# EAGLE design X15-ESC-CONTROLLER - Copy (EAGLE 9.6.2)
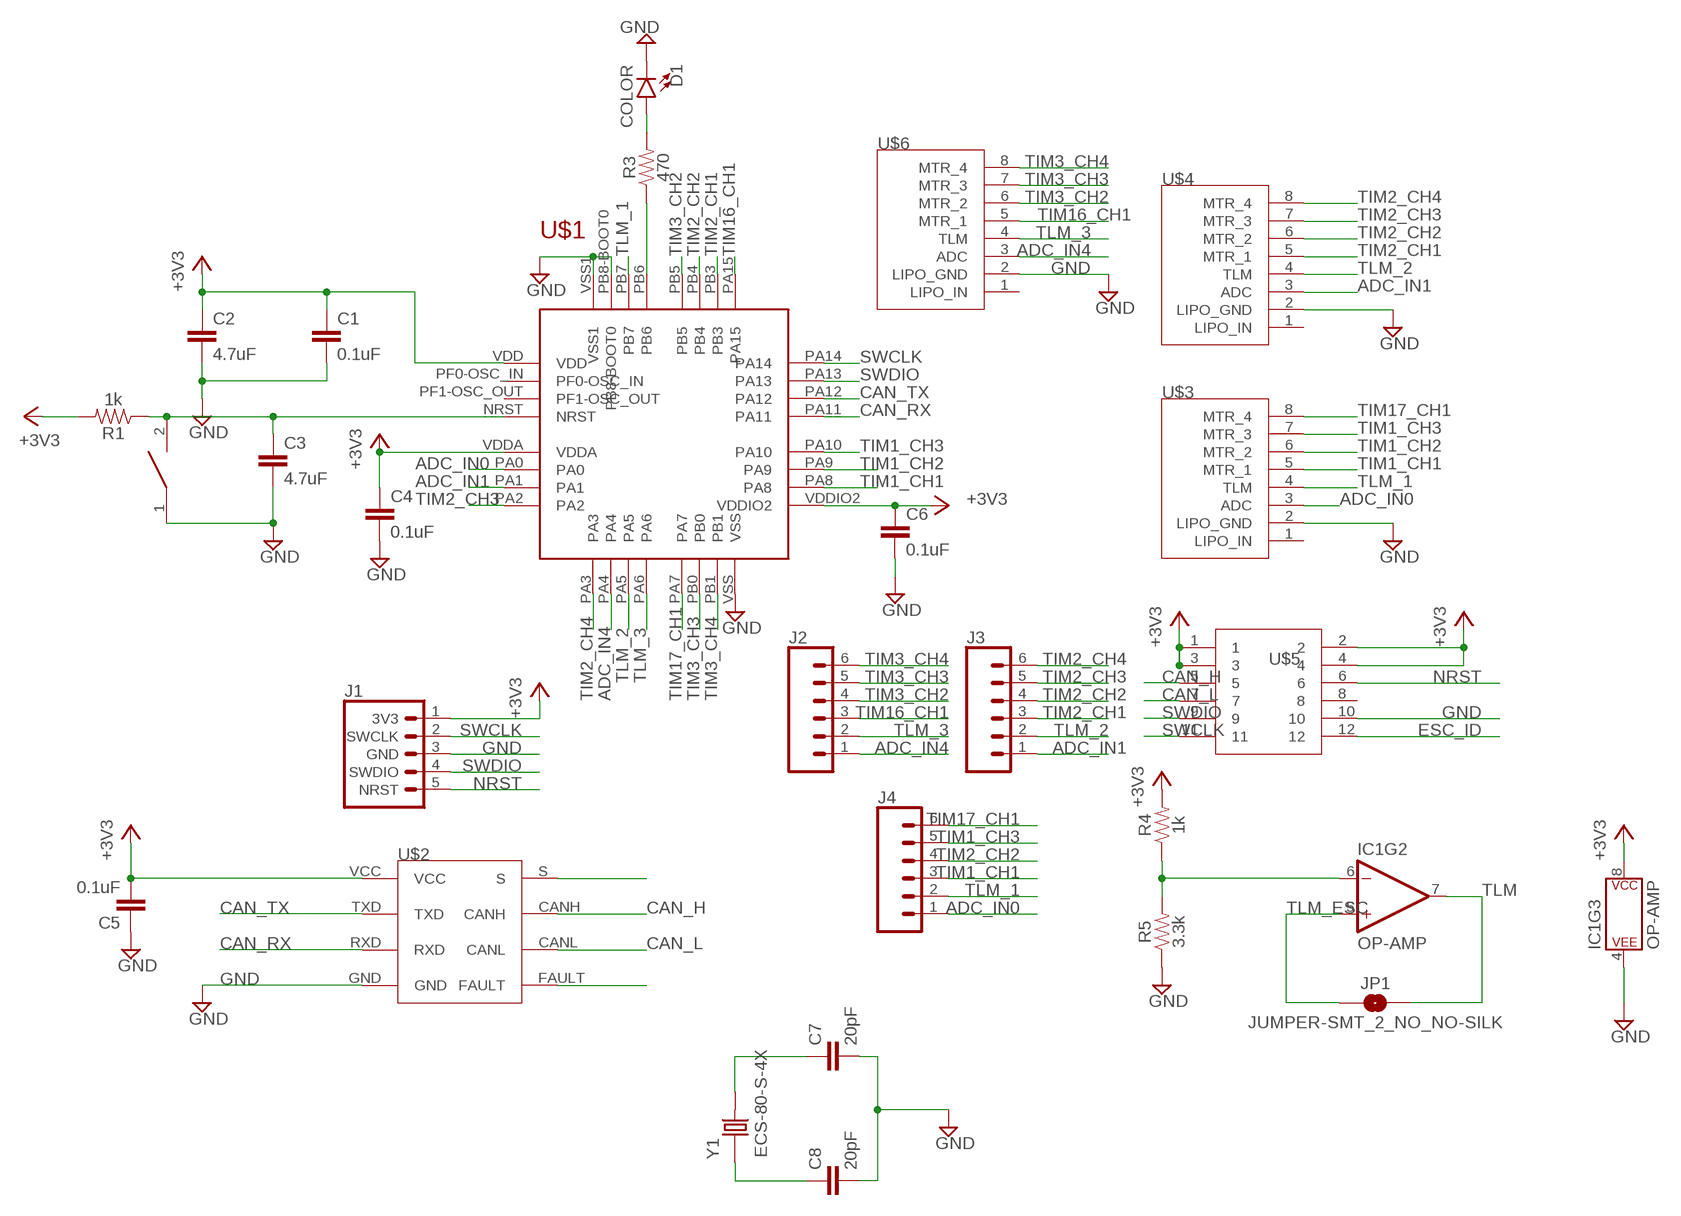
[diagram p0: schematic, sheet 1]

## Parts
C1  0.1uF  0.1UF-0603-25V-5%  [0603]
C2  4.7uF  4.7UF-0603-6.3V-(10%)  [0603]
C3  4.7uF  4.7UF-0603-6.3V-(10%)  [0603]
C4  0.1uF  0.1UF-0603-50V-10%-X7R-WE  [0603]
C5  0.1uF  0.1UF-0603-25V-(+80/-20%)  [0603]
C6  0.1uF  0.1UF-0603-25V-(+80/-20%)  [0603]
C7  20pF  20PF-0402T-50V-5%  [0402-TIGHT]
C8  20pF  20PF-0402T-50V-5%  [0402-TIGHT]
D1  COLOR  LED-0805  [0805]
IC1  OP-AMP  OPAMP-DUALU  [SO08]
J1  3V3 -SWCLK-GND-SWDIO- NRST  SWD_CONN  [1X05]
J2  CONN_06NO_SILK_NO_POP  [1X06_NO_SILK]
J3  CONN_06NO_SILK_NO_POP  [1X06_NO_SILK]
J4  CONN_06NO_SILK_NO_POP  [1X06_NO_SILK]
JP1  JUMPER-SMT_2_NO_NO-SILK  [SMT-JUMPER_2_NO_NO-SILK]
R1  1k  1KOHM-0603-1/10W-1%  [0603]
R3  470  10KOHM-0603-1/10W-1%  [0603]
R4  1k  1KOHM-0603-1/10W-1%  [0603]
R5  3.3k  1KOHM-0603-1/10W-1%  [0603]
U$1  STM32F042K6T6  [STM32F042K6T6]
U$2  TCAN337D  [TCAN337D]
U$3  JST_8_PIN  [JST_8_PIN]
U$4  JST_8_PIN  [JST_8_PIN]
U$5  BAKCPLANE_CONNECTOR  [BACKPLANE_CONNECTORS_BKP]
U$6  JST_8_PIN  [JST_8_PIN]
U$7  DISCRETECOMPONENTS_SWITCH  [DISCRETECOMPONENTS_SW_2512]
Y1  ECS-80-S-4X  [XTAL_ECS-80-S-4X]

## Nets
+3V3: C1.1 C2.1 C4.1 C5.2 C6.1 IC1.8(P$V+) J1.1(3V3) R1.2 R4.2 U$1.VDD U$1.VDDA U$1.VDDIO2 U$2.VCC U$5.1 U$5.2 U$5.3 U$5.4
ADC_IN0: J4.1 U$1.PA0 U$3.3(ADC)
ADC_IN1: J3.1 U$1.PA1 U$4.3(ADC)
ADC_IN4: J2.1 U$1.PA4 U$6.3(ADC)
CAN_H: U$2.CANH U$5.5
CAN_L: U$2.CANL U$5.7
CAN_RX: U$1.PA11 U$2.RXD
CAN_TX: U$1.PA12 U$2.TXD
ESC_ID: U$5.12
GND: C1.2 C2.2 C3.2 C4.2 C5.1 C6.2 C7.2 C8.2 D1.C IC1.4(P$V-) J1.3(GND) R5.1 U$1.PB8-BOOT0 U$1.VSS U$1.VSS1 U$2.GND U$3.2(LIPO_GND) U$4.2(LIPO_GND) U$5.10 U$6.2(LIPO_GND) U$7.1
N$2: C3.1 R1.1 U$1.NRST U$7.2
N$3: IC1.6(-IN) R4.1 R5.2
N$4: R3.1 U$1.PB6
N$6: C7.1 Y1.2
N$7: C8.1 Y1.1
N$8: D1.A R3.2
N$9: U$2.S
N$12: U$2.FAULT
NRST: J1.5(NRST) U$5.6
SWCLK: J1.2(SWCLK) U$1.PA14 U$5.11
SWDIO: J1.4(SWDIO) U$1.PA13 U$5.9
TIM1_CH1: J4.3 U$1.PA8 U$3.5(MTR_1)
TIM1_CH2: U$1.PA9 U$3.6(MTR_2)
TIM1_CH3: J4.5 U$1.PA10 U$3.7(MTR_3)
TIM2_CH1: J3.3 U$1.PB3 U$4.5(MTR_1)
TIM2_CH2: J3.4 J4.4 U$1.PB4 U$4.6(MTR_2)
TIM2_CH3: J3.5 U$1.PA2 U$4.7(MTR_3)
TIM2_CH4: J3.6 U$1.PA3 U$4.8(MTR_4)
TIM3_CH2: J2.4 U$1.PB5 U$6.6(MTR_2)
TIM3_CH3: J2.5 U$1.PB0 U$6.7(MTR_3)
TIM3_CH4: J2.6 U$1.PB1 U$6.8(MTR_4)
TIM16_CH1: J2.3 U$1.PA15 U$6.5(MTR_1)
TIM17_CH1: J4.6 U$1.PA7 U$3.8(MTR_4)
TLM: IC1.7(OUT) JP1.2
TLM_1: J4.2 U$1.PB7 U$3.4(TLM)
TLM_2: J3.2 U$1.PA5 U$4.4(TLM)
TLM_3: J2.2 U$1.PA6 U$6.4(TLM)
TLM_ESC: IC1.5(+IN) JP1.1
Unconnected: IC1.1(OUT) IC1.2(-IN) IC1.3(+IN) U$1.PF0-OSC_IN U$1.PF1-OSC_OUT U$3.1(LIPO_IN) U$4.1(LIPO_IN) U$5.8 U$6.1(LIPO_IN)

## Library data of the parts
C1 = SparkFun-Capacitors:0.1UF: 0.1µF ceramic capacitors A capacitor is a passive two-terminal electrical component used to store electrical energy temporarily in an electric field.; PROD_ID: CAP-08604
C2 C3 = SparkFun-Capacitors:4.7UF: 4.7µF ceramic capacitors A capacitor is a passive two-terminal electrical component used to store electrical energy temporarily in an electric field.; PROD_ID: CAP-08280
C4 = SparkFun-Capacitors:0.1UF: 0.1µF ceramic capacitors A capacitor is a passive two-terminal electrical component used to store electrical energy temporarily in an electric field.; PROD_ID: CAP-16523
C5 C6 = SparkFun-Capacitors:0.1UF: 0.1µF ceramic capacitors A capacitor is a passive two-terminal electrical component used to store electrical energy temporarily in an electric field.; PROD_ID: CAP-00810
C7 C8 = SparkFun-Capacitors:20PF: 20pF ceramic capacitors A capacitor is a passive two-terminal electrical component used to store electrical energy temporarily in an electric field.; PROD_ID: CAP-14843
D1 = LED, 0805:LED-0805
IC1 = SparkFun-IC-Amplifiers:OPAMP-DUAL: Generic op-amp footprint This component is for the standard 358 pinning of a dual op-amp From the LM358 datasheet: Pin 1: Output A Pin 2: Inverting Input A Pin 3: Non-Inverting Input A Pin 4: Gnd Pin 5: Non-Inverting Input B Pin 6: Inverting Input B Pin 7: Output B Pin 8: V+; PROD_ID: NA-XXXXX
J1 = X15-ESC-Controller-Parts-Library:SWD_CONN
J2-J4 = SparkFun-Connectors:CONN_06: Multi connection point. Often used as Generic Header-pin footprint for 0.1 inch spaced/style header connections On any of the 0.1 inch spaced packages, you can populate with these: Break Away Headers - Straight <https://www.sparkfun.com/products/116> (PRT-00116) Break Away Male Headers - Right Angle <https://www.sparkfun.com/products/553> (PRT-00553) Female Headers <https://www.sparkfun.com/products/115> (PRT-00115) Break Away Headers - Machine Pin <https://www.sparkfun.com/products/117> (PRT-00117) Break Away Female Headers - Swiss Machine Pin <https://www.sparkfun.com/products/743> (PRT-00743) Arduino Stackable Header - 6 Pin <https://www.sparkfun.com/products/9280> (PRT-09280) Screw Terminals 2.54mm Pitch (6-Pin) <https://www.sparkfun.com/products/16499> (PRT-16499) For SCREWTERMINALS and SPRING TERMINALS visit here: Screw Terimnals on SparkFun.com <https://www.sparkfun.com/search/results?term=Screw+Terminals> (5mm/3.5mm/2.54mm spacing) This device is also useful as a general connection point to wire up your design to another part of your project. Our various solder wires solder well into these plated through hole pads. Hook-Up Wire - Assortment (Stranded, 22 AWG) <https://www.sparkfun.com/products/11375> (PRT-11375) Hook-Up Wire - Assortment (Solid Core, 22 AWG) <https://www.sparkfun.com/products/11367> (PRT-11367) View the entire wire category on our website here <https://www.sparkfun.com/categories/141>
JP1 = SparkFun-Jumpers:JUMPER-SMT_2_NO: Normally open jumper This jumper has two pads in close proximity to each other. Apply solder to close the connection. Round pads are easier to solder for beginners, but are a lot larger. SparkFun Product that uses the round pads: SparkFun EL Sequencer <https://www.sparkfun.com/products/12781>
R1 R4 = SparkFun-Resistors:1KOHM: 1kΩ resistor A resistor is a passive two-terminal electrical component that implements electrical resistance as a circuit element. Resistors act to reduce current flow, and, at the same time, act to lower voltage levels within circuits. - Wikipedia; PROD_ID: RES-07856
R3 = SparkFun-Resistors:10KOHM: 10kΩ resistor A resistor is a passive two-terminal electrical component that implements electrical resistance as a circuit element. Resistors act to reduce current flow, and, at the same time, act to lower voltage levels within circuits. - Wikipedia; PROD_ID: RES-00824; VALUE: 10k
R5 = SparkFun-Resistors:1KOHM: 1kΩ resistor A resistor is a passive two-terminal electrical component that implements electrical resistance as a circuit element. Resistors act to reduce current flow, and, at the same time, act to lower voltage levels within circuits. - Wikipedia; PROD_ID: RES-07856; VALUE: 1k
U$1 = X15-ESC-Controller-Parts-Library:STM32F042K6T6
U$2 = X15-ESC-Controller-Parts-Library:TCAN337D
U$3 U$4 U$6 = X15-ESC-Controller-Parts-Library:JST_8_PIN
U$5 = X15-ESC-Controller-Parts-Library:BAKCPLANE_CONNECTOR
U$7 = OTHER, Push button - FSM2JMTR:DISCRETECOMPONENTS_SWITCH: TE Connectivity FSM2JMTR Switch
Y1 = X15-ESC-Controller-Parts-Library:ECS-80-S-4X: CRYSTAL T/H; DESCRIPTION: Crystal 8MHz Series 2-Pin HC-49/U; DIGI-KEY_PART_NUMBER: X1057-ND; DIGI-KEY_PURCHASE_URL: https://www.digikey.com/product-detail/en/ecs-inc/ECS-80-S-4X/X1057-ND/827549?utm_source=snapeda&utm_medium=aggregator&utm_campaign=symbol; MF: ECS International; MP: ECS-80-S-4X; PACKAGE: HC-49/US ECS International

## Board
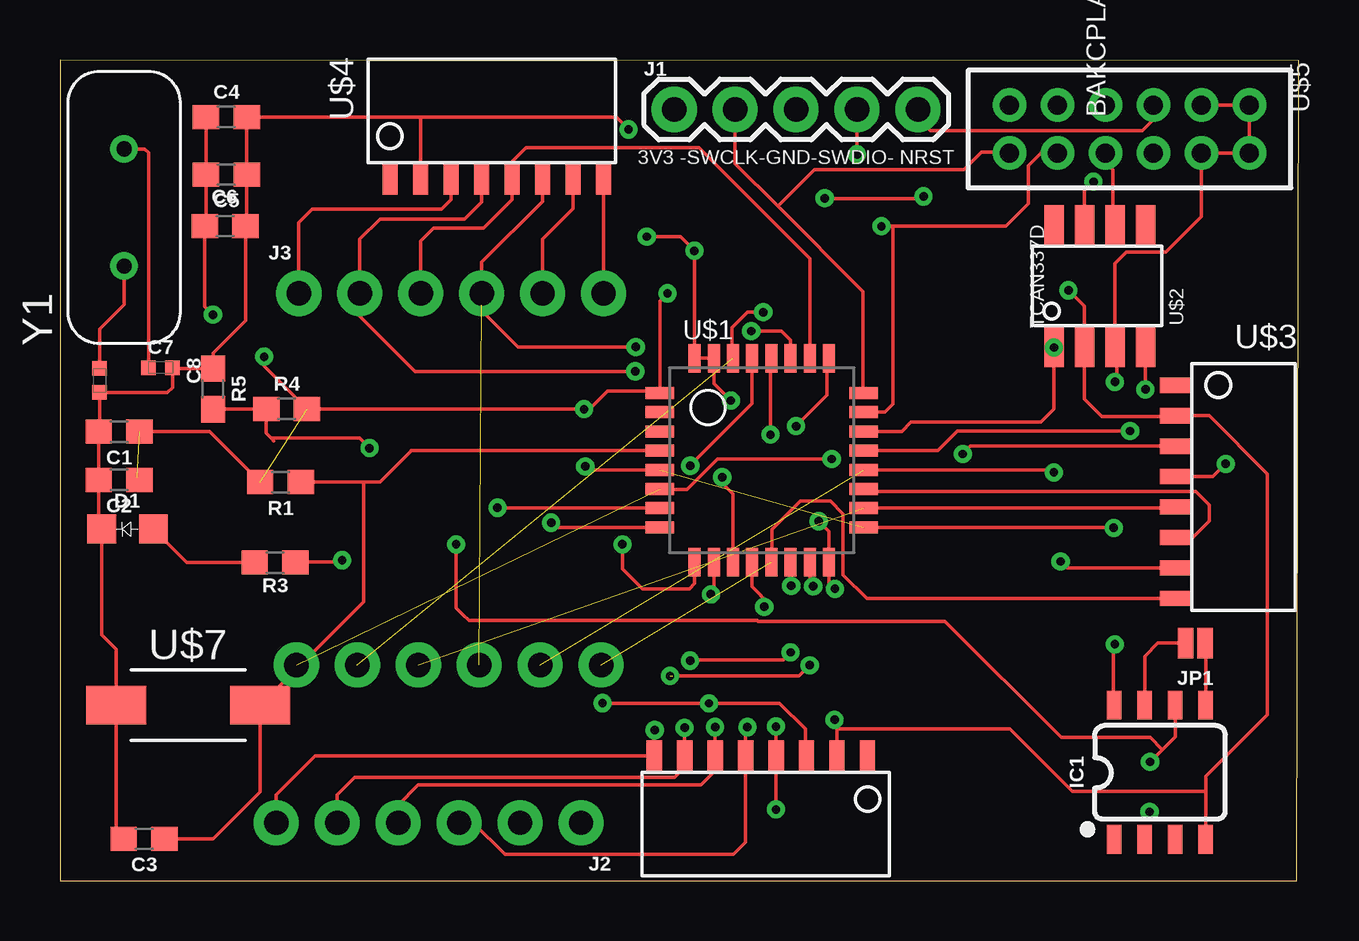
[diagram p1: board, top side]
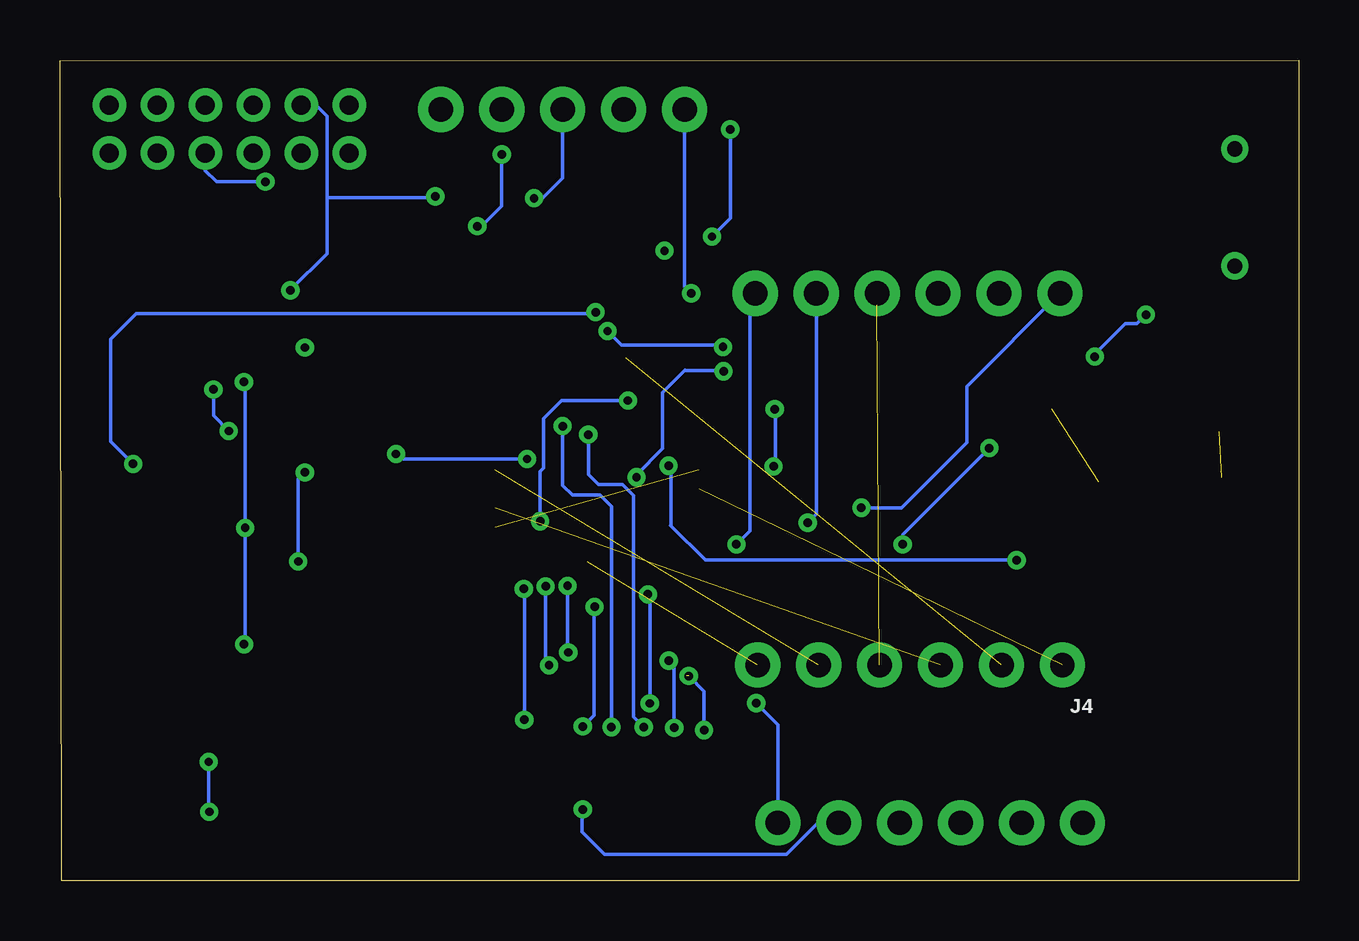
[diagram p2: board, bottom side, seen from below]

Size 51.64 x 34.21 mm. Coordinates in mm from the lower left corner, seen from the top.
Outline: 0,0 51.56,0 51.64,34.19 0,34.21 0,0
Copper layers (1*16): Top 0.035mm / dielectric 1.5mm / Bottom 0.035mm
Design rules "default": minimum track width 6mil, minimum drill 0.35mm, track to track 6mil, track to pad 6mil, pad to pad 6mil, via to via 6mil, smd to smd 6mil, copper to edge 40mil, drill to drill 6mil, minimum pad ring 10mil, minimum via ring 8mil, stop-mask expansion 4mil, vias tented up to drill 0mil, thermal gap 10mil

### Footprints (pad centres in the part's own frame; a part is rotated, then mirrored left to right if it is on the bottom)
0603 = smd 1.1 x 1: 1 -0.85,0; 2 0.85,0
0402-TIGHT = smd 0.6 x 0.6: 1 -0.5,0; 2 0.5,0
0805 = smd 1.2 x 1.2: A 1.1,0; C -1.05,0
SO08 = smd 0.6 x 1.2: 1 -1.905,-2.8; 2 -0.635,-2.8; 3 0.635,-2.8; 4 1.905,-2.8; 5 1.905,2.8; 6 0.635,2.8; 7 -0.635,2.8; 8 -1.905,2.8
1X05 = drill 1.016 pad 1.88: 1 0,0; 2 2.54,0; 3 5.08,0; 4 7.62,0; 5 10.16,0
1X06_NO_SILK = drill 1.016 pad 1.88: 1 0,0; 2 2.54,0; 3 5.08,0; 4 7.62,0; 5 10.16,0; 6 12.7,0
SMT-JUMPER_2_NO_NO-SILK = smd 0.635 x 1.27: 1 -0.406,0; 2 0.406,0
STM32F042K6T6 = smd 1.2 x 0.5: NRST 0,3.2; PA0 0,1.6; PA1 0,0.8; PA2 0,0; PA8 8.5,0.8; PA9 8.5,1.6; PA10 8.5,2.4; PA11 8.5,3.2; PA12 8.5,4; PA13 8.5,4.8; PA14 8.5,5.6; PF0-OSC_IN 0,4.8; PF1-OSC_OUT 0,4; VDD 0,5.6; VDDA 0,2.4; VDDIO2 8.5,0 | smd 0.5 x 1.2: PA3 1.45,-1.45; PA4 2.25,-1.45; PA5 3.05,-1.45; PA6 3.85,-1.45; PA7 4.65,-1.45; PA15 7.05,7.05; PB0 5.45,-1.45; PB1 6.25,-1.45; PB3 6.25,7.05; PB4 5.45,7.05; PB5 4.65,7.05; PB6 3.85,7.05; PB7 3.05,7.05; PB8-BOOT0 2.25,7.05; VSS 7.05,-1.45; VSS1 1.45,7.05
TCAN337D = smd 1.676 x 0.813: CANH 5.08,-1.27; CANL 5.08,-2.54; FAULT 5.08,-3.81; GND 0,-1.27; RXD 0,-3.81; S 5.08,0; TXD 0,0; VCC 0,-2.54
JST_8_PIN = smd 1.27 x 0.635: 1 0,-8.89; 2 0,-7.62; 3 0,-6.35; 4 0,-5.08; 5 0,-3.81; 6 0,-2.54; 7 0,-1.27; 8 0,0
BACKPLANE_CONNECTORS_BKP = drill 0.79 pad 1.39: 1 -1,-5; 2 1,-5; 3 -1,-3; 4 1,-3; 5 -1,-1; 6 1,-1; 7 -1,1; 8 1,1; 9 -1,3; 10 1,3; 11 -1,5; 12 1,5
DISCRETECOMPONENTS_SW_2512 = smd 2.5 x 1.6: 1 -3,0; 2 3,0
XTAL_ECS-80-S-4X = drill 0.63 pad 1.03: 1 -2.44,0; 2 2.44,0

### Placement (x,y rotation side)
C1  2.46,18.72 180 top
C2  2.46,16.71 180 top
C3  3.51,1.75 180 top
C4  6.93,31.83 0 top
C5  6.93,29.44 180 top
C6  6.88,27.28 0 top
C7  4.19,21.39 0 top
C8  1.65,20.85 270 top
D1  2.79,14.66 0 top
IC1  45.85,4.52 0 top
J1  25.6,32.15 0 top
J2  21.72,2.41 180 top
J3  9.96,24.49 0 top
J4  9.86,8.99 180 bottom
JP1  47.32,9.91 180 top
R1  9.19,16.61 180 top
R3  8.97,13.26 180 top
R4  9.45,19.66 0 top
R5  6.38,20.5 270 top
U$1  25,14.73 0 top
U$2  41.43,22.25 90 top
U$3  46.48,11.76 180 top
U$4  22.65,29.24 270 top
U$5  44.58,31.33 90 top
U$6  24.77,5.21 90 top
U$7  5.33,7.32 0 top
Y1  2.67,28.07 90 top

### Tracks (layer width: path | path; a pad name or v marks a point on that pad's centre or on a via)
+3V3  (via drill 0.35)  (3 unrouted)
  Top 0.152: U$5.4 U$5.2 U$5.1 U$5.3 47.58,27.69 46.1,26.21 44.45,26.21 43.97,25.73 U$2.VCC 44.05,22.17 44.05,20.87 v43.97,20.79 | v43.97,9.86 43.92,9.8 43.92,7.35 IC1.8 | v43.92,14.71 43.9,14.73 U$1.VDDIO2 | C4.1 C5.2 6.08,27.33 C6.1 6.03,23.94 v6.38,23.6 | 3.21,16.82 C2.1 | R1.2 6.24,18.72 C1.1 | v8.51,21.84 8.51,21.45 R4.2 v21.84,19.66 22.07,19.66 22.83,20.41 24.92,20.41 U$1.VDD 25,24.16 v25.32,24.49 | U$1.VDDA 22.04,17.13 v21.89,17.27
  Bottom 0.152: v43.97,20.79 43.92,20.74 v43.92,14.71 43.92,9.9 v43.97,9.86 | v6.38,23.6 6.76,23.22 7.24,23.22 8.51,21.95 v8.51,21.84 | v21.84,19.66 21.82,19.63 21.82,17.35 v21.89,17.27 | J1.1 25.6,24.77 v25.32,24.49
ADC_IN0  (via drill 0.35)  (1 unrouted)
  Top 0.152: 32.26,17.58 v32.17,17.58 27.41,17.58 26.14,16.31 25.03,16.31 U$1.PA0 | U$3.3 37.96,18.11 v37.63,17.79
  Bottom 0.152: v37.63,17.79 37.42,17.58 v32.17,17.58
ADC_IN1  (via drill 0.35)
  Top 0.152: U$4.3 16.3,28.39 15.9,27.99 10.52,27.99 9.96,27.43 J3.1 | U$1.PA1 18.25,15.53 v18.24,15.54
  Bottom 0.152: J3.1 13.84,20.6 13.84,18.26 16.56,15.54 v18.24,15.54
ADC_IN4  (via drill 0.35)
  Top 0.152: U$1.PA4 27.26,11.99 | 27.26,11.99 27.26,11.94 | U$6.3 31.07,5.26 31.07,6.32 30,7.39 v27.05,7.39 22.62,7.39 v22.61,7.4 | 27.26,11.99 27.21,11.94 v27.13,11.94
  Bottom 0.152: v27.13,11.94 27.05,11.86 v27.05,7.39 | J2.1 21.72,6.5 v22.61,7.4
CAN_H  (via drill 0.35)
  Top 0.152: U$2.CANH 42.7,28.76 v43.08,29.13
  Bottom 0.152: v43.08,29.13 45.11,29.13 45.58,29.6 U$5.5
CAN_L
  Top 0.152: 43.77,27.53 43.88,27.42 | 43.88,27.42 U$2.CANL | U$5.7 43.58,29.95 43.89,29.64 43.89,27.43 43.88,27.42
CAN_RX  (via drill 0.35)
  Top 0.152: U$2.RXD v45.24,20.48 | U$1.PA11 36.6,17.93 37.41,18.75 v44.6,18.75
  Bottom 0.152: v44.6,18.75 45.24,19.39 v45.24,20.48
CAN_TX  (via drill 0.35)
  Top 0.152: U$1.PA12 35.09,18.73 35.47,19.11 40.88,19.11 41.43,19.66 v41.43,22.23 U$2.TXD
GND  (via drill 0.35)
  Top 0.152: U$2.GND 42.7,22.91 | U$2.GND 42.7,20.09 43.43,19.36 46.45,19.36 U$3.2 47.9,19.39 50.33,16.96 50.33,6.92 47.75,4.34 47.75,3.73 | IC1.4 47.75,3.73 | 47.75,3.73 42.19,3.73 39.6,6.33 32.39,6.33 | U$2.GND 42.7,23.95 v42.04,24.61 | v31.62,14.99 32.05,14.56 U$1.VSS 32.05,12.42 v32.3,12.17 | v27.96,20.02 27.25,20.73 U$1.PB8-BOOT0 U$1.VSS1 26.45,26.25 v26.44,26.26 25.86,26.85 v24.46,26.85 | v31.88,28.45 31.9,28.42 35.89,28.42 v35.99,28.52 | 15.06,31.83 C4.2 C5.1 7.78,27.33 C6.2 7.73,23.35 6.38,22 R5.1 4.7,21.35 4.69,21.34 | C3.2 2.33,2.07 U$7.1 2.33,9.65 1.74,10.24 D1.C 1.61,14.79 C2.2 | C7.2 4.69,21.34 | 1.84,16.48 C2.2 | 4.69,21.34 4.69,20.57 4.48,20.35 C8.2 1.65,18.82 1.75,18.72 C1.2 C2.2 | U$6.2 32.39,6.33 | 32.39,6.33 32.39,6.6 v32.28,6.71 | 15.06,31.83 23.19,31.83 v23.7,31.32 | 15.06,31.83 15.03,31.8 U$4.2
  Bottom 0.152: U$5.10 40.97,32.33 40.5,31.86 40.5,28.42 | 40.5,28.42 40.5,26.15 v42.04,24.61 | v31.62,14.99 31.62,17.05 31.47,17.2 31.47,19.28 30.73,20.02 v27.96,20.02 | J1.3 30.68,29.29 31.52,28.45 v31.88,28.45 | v35.99,28.52 36.04,28.47 40.45,28.47 40.5,28.42 | v23.7,31.32 23.7,27.61 v24.46,26.85 | v32.28,6.71 32.28,12.15 v32.3,12.17
N$2
  Top 0.152: C3.1 6.38,1.75 8.33,3.71 U$7.2 12.65,11.63 12.65,16.59 12.68,16.61 | U$1.NRST 14.66,17.93 | 14.66,17.93 14.63,17.93 | 14.66,17.93 13.34,16.61 12.68,16.61 | 12.68,16.61 R1.1
N$3  (via drill 0.35)
  Top 0.152: IC1.6 46.48,5.99 45.95,5.46 | 45.95,5.46 v45.44,4.95 | R5.2 R4.1 8.6,18.66 8.8,18.45 | 45.95,5.46 45.44,5.97 41.73,5.97 36.89,10.81 29.1,10.81 29.06,10.85 17.04,10.85 16.79,11.1 16.51,11.38 v16.51,14.02 | 8.91,18.34 8.8,18.45 | 8.8,18.45 12.48,18.45 v12.9,18.03
  Bottom 0.152: v45.44,4.95 45.44,2.9 v45.41,2.87 | v12.9,18.03 16.51,14.43 v16.51,14.02
N$4  (via drill 0.35)
  Top 0.152: U$1.PB6 28.85,19.89 v26.27,17.3 | R3.1 9.84,13.28 11.68,13.28 v11.76,13.36
  Bottom 0.152: v11.76,13.36 24.74,13.36 26.18,14.8 | 26.18,14.8 26.19,14.81 | 26.18,14.8 26.18,17.2 v26.27,17.3
N$6
  Top 0.152: Y1.2 3.53,30.5 3.69,30.34 C7.1
N$7
  Top 0.152: C8.1 1.65,22.99 2.67,24.01 Y1.1
N$8
  Top 0.152: R3.2 5.29,13.26 D1.A
NRST
  Top 0.152: J1.5 35.76,31.77 36.28,31.26 45.11,31.26 45.58,31.73 U$5.6
SWCLK
  Top 0.152: J1.2 28.14,29.9 29.92,28.12 | U$1.PA14 33.48,20.36 33.48,24.56 29.92,28.12 | U$5.11 39.53,30.38 38.41,30.38 37.67,29.64 31.45,29.64 29.92,28.12
SWDIO  (via drill 0.35)
  Top 0.152: U$1.PA13 34.39,19.53 34.72,19.86 34.72,27.2 34.65,27.28 | J1.4 v33.22,30.28 | v34.24,27.28 34.65,27.28 | U$5.9 40.88,30.33 40.5,29.96 40.5,29.95 40.36,29.81 40.36,28.22 39.42,27.28 34.65,27.28
  Bottom 0.152: v33.22,30.28 33.22,28.12 34.06,27.28 v34.24,27.28
TIM1_CH1  (1 unrouted)
  Top 0.152: 33.62,15.42 U$1.PA8 46.44,15.53 U$3.5
TIM1_CH2
  Top 0.152: U$1.PA9 33.6,16.23 47.35,16.23 47.9,15.67 47.9,14.99 47.22,14.3 U$3.6
TIM1_CH3  (via drill 0.35)  (1 unrouted)
  Top 0.152: U$3.7 41.98,13.04 v41.71,13.31 | v41.43,17.02 41.32,17.13 U$1.PA10
  Bottom 0.152: v41.71,13.31 41.71,16.74 v41.43,17.02
TIM2_CH1
  Top 0.152: J3.3 15.04,26.67 15.57,27.2 17.65,27.2 18.84,28.39 U$4.5 18.84,29.97 19.43,30.56 26.64,30.56 31.25,25.94 U$1.PB3
TIM2_CH2  (via drill 0.35)  (1 unrouted)
  Top 0.152: U$4.6 20.11,28.32 17.58,25.78 J3.4 | J3.4 17.58,24 | U$1.PB4 30.45,22.53 30.07,22.91 v28.81,22.91 | J3.4 17.58,23.77 19.1,22.25 v24,22.25
  Bottom 0.152: v24,22.25 24.08,22.33 28.23,22.33 v28.81,22.91
TIM2_CH3  (via drill 0.35)
  Top 0.152: U$4.7 21.38,28.01 20.12,26.75 J3.5 | v20.47,14.92 20.67,14.73 U$1.PA2
  Bottom 0.152: J3.5 20.12,15.28 v20.47,14.92
TIM2_CH4  (via drill 0.35)
  Top 0.152: U$4.8 J3.6 | U$1.PA3 26.45,12.38 26.24,12.17 24.28,12.17 23.44,13.01 v23.44,14.02
  Bottom 0.152: J3.6 22.89,24.26 22.89,14.58 v23.44,14.02
TIM3_CH2  (via drill 0.35)
  Top 0.152: v27.3,6.4 v27.31,6.4 U$6.6 27.31,4.58 26.72,3.99 14.94,3.99 14.1,3.15 J2.4 | v29.62,18.59 29.62,21.74 U$1.PB5
  Bottom 0.152: v27.3,6.4 27.74,6.83 27.74,16.05 28.19,16.51 29.18,16.51 29.62,16.94 v29.62,18.59
TIM3_CH3  (via drill 0.35)
  Top 0.152: v26.26,9.17 26.31,9.21 30.15,9.21 v30.45,9.52 | v26.04,6.38 v26.04,6.37 U$6.7 26.04,4.73 25.62,4.3 12.28,4.3 11.56,3.58 J2.5 | U$1.PB0 30.45,12.32 v30.48,12.29
  Bottom 0.152: v26.26,9.17 26.04,9.17 v26.04,6.38 | v30.48,12.29 30.48,9.54 v30.45,9.52
TIM3_CH4  (via drill 0.35)  (1 unrouted)
  Top 0.152: 25.53,8.53 30.81,8.53 v31.25,8.98 | U$1.PB1 31.25,12.41 v31.39,12.27 | J2.6 9.02,3.58 10.64,5.21 U$6.8 24.77,6.25 v24.79,6.27
  Bottom 0.152: v31.39,12.27 31.39,9.12 v31.25,8.98 | v24.79,6.27 24.79,7.9 v25.43,8.53
TIM16_CH1  (via drill 0.35)
  Top 0.152: v28.65,6.4 28.58,6.47 U$6.5 28.58,1.6 28.07,1.09 18.54,1.09 17.22,2.41 J2.3 | U$1.PA15 31.98,21.71 31.98,20.24 v30.68,18.95
  Bottom 0.152: v28.65,6.4 28.65,15.6 29.13,16.08 30.28,16.08 30.68,16.48 v30.68,18.95
TIM17_CH1  (1 unrouted)
  Top 0.152: U$3.8 33.62,11.77 32.64,12.75 32.64,15.29 32.11,15.82 30.86,15.82 29.68,14.64 29.68,13.3 U$1.PA7
TLM
  Top 0.152: JP1.2 45.77,9.91 45.21,9.35 IC1.7
TLM_1  (via drill 0.35)  (1 unrouted)
  Top 0.152: v29.31,23.7 28.65,23.7 28,23.05 28,21.83 U$1.PB7 | U$3.4 48.06,16.84 v48.59,17.37
  Bottom 0.152: v48.59,17.37 49.53,18.31 49.53,22.58 48.46,23.65 29.36,23.65 v29.31,23.7
TLM_2  (via drill 0.35)
  Top 0.152: U$4.4 17.57,28.29 16.87,27.58 13.34,27.58 12.5,26.75 J3.2 12.5,23.55 14.81,21.23 v23.98,21.23 | U$1.PA5 28.05,16.12 27.61,16.56 v27.61,16.82
  Bottom 0.152: v27.61,16.82 27.61,16.92 26.52,18.01 26.52,20.34 25.6,21.26 | 25.6,21.26 25.58,21.29 | 25.6,21.26 24,21.26 v23.98,21.23
TLM_3  (via drill 0.35)
  Top 0.152: v29.84,6.43 v29.85,6.42 U$6.4 v29.84,2.97 | v29.35,11.41 29.35,11.74 29.23,11.87 29.23,11.9 28.85,12.27 U$1.PA6
  Bottom 0.152: v29.35,11.41 29.39,11.41 29.39,6.88 v29.84,6.43 | J2.2 20.04,2.41 21.36,1.09 28.93,1.09 29.87,2.03 29.87,2.97 v29.84,2.97
TLM_ESC
  Top 0.152: IC1.5 47.75,9.88 JP1.1